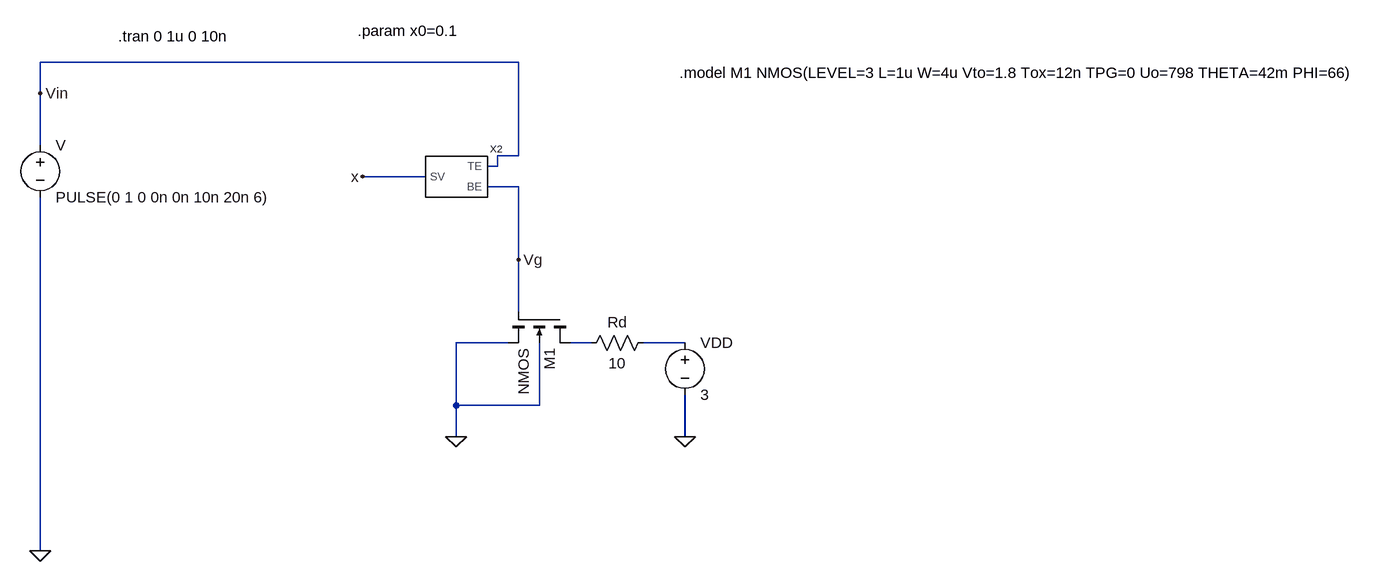
[diagram p0: schematic neuro_memristor _test.asc]
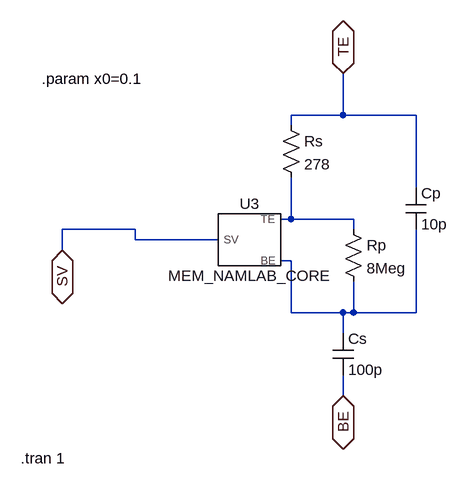
[diagram p1: sub-circuit pseudo_memcapacitor.asc]
neuro_memristor _test.asc, the LTspice schematic file:
Version 4
SHEET 1 1940 960
WIRE 528 -160 -208 -160
WIRE -208 -112 -208 -160
WIRE -208 -32 -208 -112
WIRE 528 -16 528 -160
WIRE 528 -16 496 -16
WIRE 496 0 496 -16
WIRE 496 0 480 0
WIRE 384 16 288 16
WIRE 528 32 480 32
WIRE 528 144 528 32
WIRE 528 224 528 144
WIRE 512 272 432 272
WIRE 640 272 608 272
WIRE 784 272 720 272
WIRE 432 368 432 272
WIRE 560 368 560 272
WIRE 560 368 432 368
WIRE 432 416 432 368
WIRE 784 416 784 352
WIRE -208 592 -208 48
FLAG -208 592 0
FLAG 288 16 x
FLAG 784 416 0
FLAG 432 416 0
FLAG -208 -112 Vin
FLAG 528 144 Vg
SYMBOL voltage -208 -48 R0
WINDOW 123 0 0 Left 0
WINDOW 39 0 0 Left 0
SYMATTR InstName V
SYMATTR Value PULSE(0 1 0 0n 0n 10n 20n 6)
SYMBOL voltage 784 256 R0
SYMATTR InstName VDD
SYMATTR Value 3
SYMBOL res 736 256 R90
WINDOW 0 0 56 VBottom 2
WINDOW 3 32 56 VTop 2
SYMATTR InstName Rd
SYMATTR Value 10
SYMBOL nmos4 608 224 R90
SYMATTR InstName M1
SYMBOL pseudo_memcapacitor 432 16 R0
SYMATTR InstName X2
TEXT -88 -200 Left 2 !.tran 0 1u 0 10n
TEXT 280 -208 Left 2 !.param x0=0.1
TEXT 776 -144 Left 2 !.model M1 NMOS(LEVEL=3 L=1u W=4u Vto=1.8 Tox=12n TPG=0 Uo=798 THETA=42m PHI=66)

pseudo_memcapacitor.asc, the sub-circuit schematic file:
Version 4
SHEET 1 880 680
WIRE 64 -80 64 -144
WIRE 64 -80 -16 -80
WIRE 176 -80 64 -80
WIRE -16 -64 -16 -80
WIRE 176 32 176 -80
WIRE -16 80 -16 16
WIRE -16 80 -32 80
WIRE 80 80 -16 80
WIRE -256 96 -368 96
WIRE 80 96 80 80
WIRE -256 112 -256 96
WIRE -128 112 -256 112
WIRE -368 128 -368 96
WIRE -16 144 -32 144
WIRE -16 224 -16 144
WIRE 64 224 -16 224
WIRE 80 224 80 176
WIRE 80 224 64 224
WIRE 176 224 176 96
WIRE 176 224 80 224
WIRE 64 256 64 224
WIRE 64 352 64 320
FLAG -368 128 SV
IOPIN -368 128 BiDir
FLAG 64 -144 TE
IOPIN 64 -144 BiDir
FLAG 64 352 BE
IOPIN 64 352 BiDir
SYMBOL cap 160 32 R0
SYMATTR InstName Cp
SYMATTR Value 10p
SYMBOL cap 48 256 R0
SYMATTR InstName Cs
SYMATTR Value 100p
SYMBOL res 64 80 R0
SYMATTR InstName Rp
SYMATTR Value 8Meg
SYMBOL res -32 -80 R0
SYMATTR InstName Rs
SYMATTR Value 278
SYMBOL MEM_NAMLAB_CORE -80 112 R0
SYMATTR InstName U3
TEXT -432 448 Left 2 !.tran 1
TEXT -400 -136 Left 2 !.param x0=0.1

The netlist it stands for:
* neuro_memristor _test.asc
V Vin 0 PULSE(0 1 0 0n 0n 10n 20n 6)
VDD N002 0 3
Rd N002 N001 10
M1 N001 Vg 0 0 NMOS
XX2 x Vin Vg pseudo_memcapacitor

* block symbol definitions
.subckt pseudo_memcapacitor SV TE BE
Cp TE N002 10p
Cs N002 BE 100p
Rp N001 N002 8Meg
Rs TE N001 278
XU3 N001 N002 SV MEM_NAMLAB_CORE  ; pins TE BE SV
.tran 1
.param x0=0.1
.ends pseudo_memcapacitor

.model NMOS NMOS
.model PMOS PMOS
.lib standard.mos
.tran 0 1u 0 10n
.param x0=0.1
.model M1 NMOS(LEVEL=3 L=1u W=4u Vto=1.8 Tox=12n TPG=0 Uo=798 THETA=42m PHI=66)
.lib C:\Users\dhanu\OneDrive\Documents\My files\GITHUB\Neuro-transistor-Simulation-with-Memristor-based-Memcapacitor-using-LTSPICE\src\Task 9 test\MEM_NAMLAB_CORE.cir
.backanno
.end

* Results of the author's LTspice run, read from the files saved beside the schematic
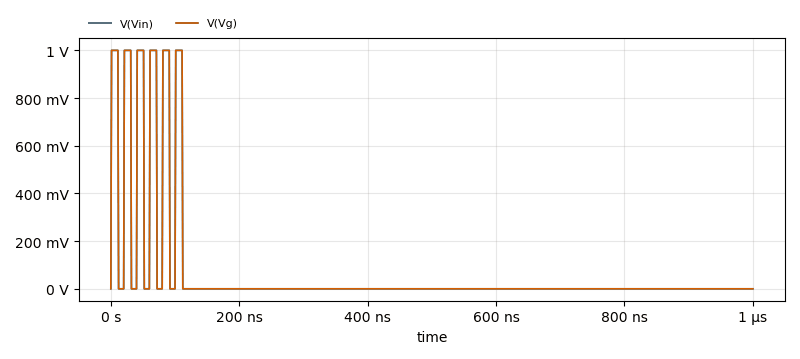
[diagram p2: Transient Analysis of neuro_memristor _test.asc, plotted from the saved traces]
* Transient Analysis, 1 run:
*   V(Vin): min 0 V, max 1 V, average 66 mV, rms 253.4 mV, last 0 V
*   V(Vg): min 0 V, max 1 V, average 66 mV, rms 253.4 mV, last 0 V